# Altium schematic sheet 板球系统驱动板.SchDoc
size A4
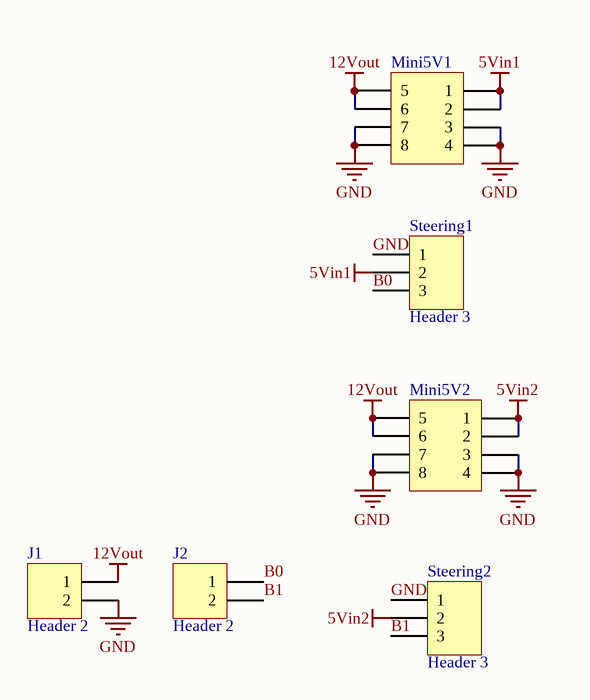
[diagram p0: 板球系统驱动板.SchDoc]

## Parts
J1  Header 2  [HDR1X2]
J2  Header 2  [HDR1X2]
Mini5V1  5V电源模块插座，向下焊  [Mini5Vpower]  (value not drawn)
Mini5V2  5V电源模块插座，向下焊  [Mini5Vpower]  (value not drawn)
Steering1  Header 3  [HDR1X3]
Steering2  Header 3  [HDR1X3]

## Nets
5Vin1: Mini5V1.1 Mini5V1.2 Steering1.2
5Vin2: Mini5V2.1 Mini5V2.2 Steering2.2
12Vout: J1.1 Mini5V1.5 Mini5V1.6 Mini5V2.5 Mini5V2.6
GND: J1.2 Mini5V1.3 Mini5V1.4 Mini5V1.7 Mini5V1.8 Mini5V2.3 Mini5V2.4 Mini5V2.7 Mini5V2.8 Steering1.1 Steering2.1
B0: J2.1 Steering1.3
B1: J2.2 Steering2.3

## Library data of the parts
J1 J2 = Header 2: Header, 2-Pin; LatestRevisionDate: 17-Jul-2002; LatestRevisionNote: Re-released for DXP Platform.; Publisher: Altium Limited
Mini5V1 Mini5V2 = Header 4X2A: Header, 4-Pin, Dual row; LatestRevisionDate: 17-Jul-2002; LatestRevisionNote: Re-released for DXP Platform.; Publisher: Altium Limited
Steering1 Steering2 = Header 3: Header, 3-Pin; LatestRevisionDate: 17-Jul-2002; LatestRevisionNote: Re-released for DXP Platform.; Publisher: Altium Limited